# EAGLE design Movuino_v0.922 (EAGLE 6.6.0)
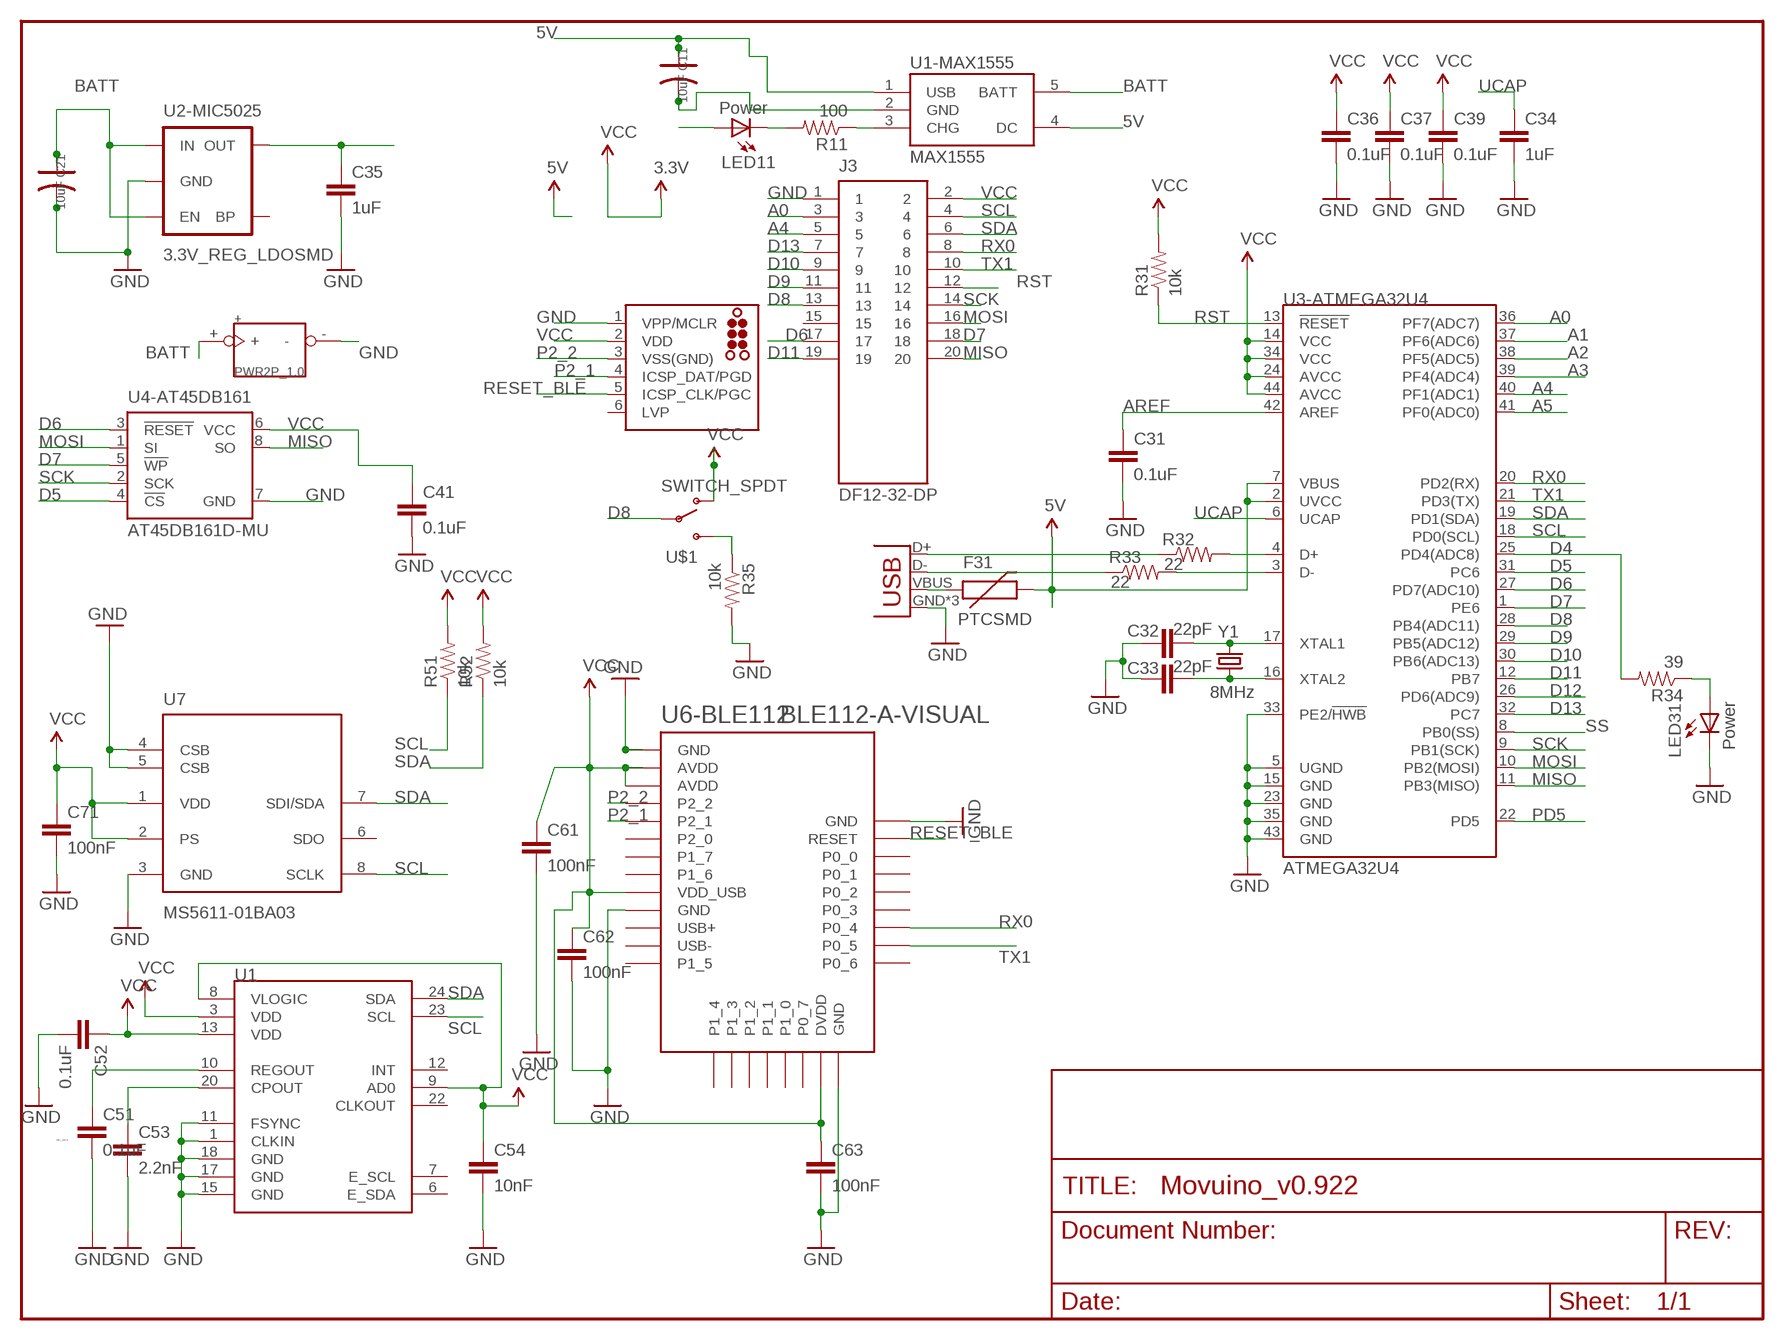
[diagram p0: schematic, sheet 1]

## Parts
+  PWR2P_1.0  [PWR2P_1.0]
C11  10uF  C-POLAR-A  [AVX-A]
C21  10uF  C-POLAR-A  [AVX-A]
C31  0.1uF  CAP0402-CAP  [0402-CAP]
C32  22pF  CAP0402-CAP  [0402-CAP]
C33  22pF  CAP0402-CAP  [0402-CAP]
C34  1uF  CAP0402-CAP  [0402-CAP]
C35  1uF  CAP0402-CAP  [0402-CAP]
C36  0.1uF  CAP0402-CAP  [0402-CAP]
C37  0.1uF  CAP0402-CAP  [0402-CAP]
C39  0.1uF  CAP0402-CAP  [0402-CAP]
C41  0.1uF  CAP0402-CAP  [0402-CAP]
C51  0.1uF  CAP0402-CAP  [0402-CAP]
C52  0.1uF  CAP0402-CAP  [0402-CAP]
C53  2.2nF  CAP0402-CAP  [0402-CAP]
C54  10nF  CAP0402-CAP  [0402-CAP]
C61  100nF  CAP0402-CAP  [0402-CAP]
C62  100nF  CAP0402-CAP  [0402-CAP]
C63  100nF  CAP0402-CAP  [0402-CAP]
C71  100nF  CAP0402-CAP  [0402-CAP]
F31  PTCSMD  [PTC-1206]
J1  TC2030-MCP-NL  [TC2030-MCP-NL]
J3  DF12-32-DP  AS-ITM-00015  [DF12-20-DP]
LED11  Power  LED0603  [LED-0603]
LED31  Power  LED0603  [LED-0603]
R11  100  RESISTOR0402-RES  [0402-RES]
R31  10k  RESISTOR0402-RES  [0402-RES]
R32  22  RESISTOR0402-RES  [0402-RES]
R33  22  RESISTOR0402-RES  [0402-RES]
R34  39  RESISTOR0402-RES  [0402-RES]
R35  10k  RESISTOR0402-RES  [0402-RES]
R51  10k  RESISTOR0402-RES  [0402-RES]
R52  10k  RESISTOR0402-RES  [0402-RES]
U1  MPU-9150QFN-24-NP  [QFN-24-NP]
U1-MAX1555  MAX1555  [SOT23-5]
U2-MIC5025  3.3V_REG_LDOSMD  V_REG_LDOSMD  [SOT23-5]
U3-ATMEGA32U4  ATMEGA32U4  ATMEGA32U4QFN2  [QFN-44-NOPAD]
U4-AT45DB161  AT45DB161D-MU  [VDFN-8]
U6-BLE112  BLE112-A-VISUAL  [BLE112-A]
U7  MS5611-01BA03  [SON125P300X500X100-8N]
U$1  SWITCH_SPDT  [KPS-1290]
X1  USB-MICROB  [USB-MICROB]
Y1  8MHz  CRYSTAL5X3  [CRYSTAL-SMD-5X3]

## Nets
5V: C11.+ F31.2 U1-MAX1555.1(USB) U1-MAX1555.4(DC) U3-ATMEGA32U4.2(UVCC) U3-ATMEGA32U4.7(VBUS)
A0: J3.3 U3-ATMEGA32U4.36(PF7(ADC7))
A1: U3-ATMEGA32U4.37(PF6(ADC6))
A2: U3-ATMEGA32U4.38(PF5(ADC5))
A3: U3-ATMEGA32U4.39(PF4(ADC4))
A4: J3.5 U3-ATMEGA32U4.40(PF1(ADC1))
A5: U3-ATMEGA32U4.41(PF0(ADC0))
AREF: C31.1 U3-ATMEGA32U4.42(AREF)
BATT: +.+ C21.+ LED11.A U1-MAX1555.5(BATT) U2-MIC5025.1(IN) U2-MIC5025.3(EN)
D4: R34.2 U3-ATMEGA32U4.25(PD4(ADC8))
D5: U3-ATMEGA32U4.31(PC6) U4-AT45DB161.4(!CS)
D6: J3.17 U3-ATMEGA32U4.27(PD7(ADC10)) U4-AT45DB161.3(!RESET)
D7: J3.18 U3-ATMEGA32U4.1(PE6) U4-AT45DB161.5(!WP)
D8: J3.13 U3-ATMEGA32U4.28(PB4(ADC11)) U$1.P
D9: J3.11 U3-ATMEGA32U4.29(PB5(ADC12))
D10: J3.9 U3-ATMEGA32U4.30(PB6(ADC13))
D11: J3.19 U3-ATMEGA32U4.12(PB7)
D12: U3-ATMEGA32U4.26(PD6(ADC9))
D13: J3.7 U3-ATMEGA32U4.32(PC7)
D+: R32.1 X1.D+
D-: R33.1 X1.D-
GND: +.- C11.- C21.- C31.2 C32.1 C33.1 C34.2 C35.2 C36.2 C37.2 C39.2 C41.2 C51.2 C52.2 C53.2 C54.2 C61.2 C62.2 C63.2 C71.2 J1.1(VPP/MCLR) J3.1 LED31.C R35.2 U1-MAX1555.2(GND) U1.1(CLKIN) U1.11(FSYNC) U1.15(GND) U1.17(GND) U1.18(GND) U2-MIC5025.2(GND) U3-ATMEGA32U4.5(UGND) U3-ATMEGA32U4.15(GND) U3-ATMEGA32U4.23(GND) U3-ATMEGA32U4.33(PE2/!HWB) U3-ATMEGA32U4.35(GND) U3-ATMEGA32U4.43(GND) U4-AT45DB161.7(GND) U6-BLE112.GND1(GND) U6-BLE112.GND2(GND) U6-BLE112.GND3(GND) U6-BLE112.GND4(GND) U7.3(GND) U7.4(CSB) U7.5(CSB) X1.GND X1.MT1(GND) X1.MT2(GND)
MISO: J3.20 U3-ATMEGA32U4.11(PB3(MISO)) U4-AT45DB161.8(SO)
MOSI: J3.16 U3-ATMEGA32U4.10(PB2(MOSI)) U4-AT45DB161.1(SI)
N$2: C32.2 U3-ATMEGA32U4.17(XTAL1) Y1.3
N$3: C33.2 U3-ATMEGA32U4.16(XTAL2) Y1.1
N$4: F31.1 X1.VBUS
N$6: R32.2 U3-ATMEGA32U4.4(D+)
N$7: R11.1 U1-MAX1555.3(CHG)
N$8: R33.2 U3-ATMEGA32U4.3(D-)
N$10: LED11.C R11.2
N$11: C51.1 U1.10(REGOUT)
N$19: C53.1 U1.20(CPOUT)
N$22: LED31.A R34.1
N$27: R35.1 U$1.S
P2_1: J1.4(ICSP_DAT/PGD) U6-BLE112.P2_1
P2_2: J1.3(VSS(GND)) U6-BLE112.P2_2
PD5: U3-ATMEGA32U4.22(PD5)
RESET_BLE: J1.5(ICSP_CLK/PGC) U6-BLE112.RESET
RST: J3.12 R31.1 U3-ATMEGA32U4.13(!RESET)
RX0: J3.8 U3-ATMEGA32U4.20(PD2(RX)) U6-BLE112.P0_4
SCK: J3.14 U3-ATMEGA32U4.9(PB1(SCK)) U4-AT45DB161.2(SCK)
SCL: J3.4 R51.1 U1.23(SCL) U3-ATMEGA32U4.18(PD0(SCL)) U7.8(SCLK)
SDA: J3.6 R52.1 U1.24(SDA) U3-ATMEGA32U4.19(PD1(SDA)) U7.7(SDI/SDA)
SS: U3-ATMEGA32U4.8(PB0(SS))
TX1: J3.10 U3-ATMEGA32U4.21(PD3(TX)) U6-BLE112.P0_5
UCAP: C34.1 U3-ATMEGA32U4.6(UCAP)
VCC: C35.1 C36.1 C37.1 C39.1 C41.1 C52.1 C54.1 C61.1 C62.1 C63.1 C71.1 J1.2(VDD) J3.2 R31.2 R51.2 R52.2 U1.3(VDD) U1.8(VLOGIC) U1.9(AD0) U1.13(VDD) U2-MIC5025.5(OUT) U3-ATMEGA32U4.14(VCC) U3-ATMEGA32U4.24(AVCC) U3-ATMEGA32U4.34(VCC) U3-ATMEGA32U4.44(AVCC) U4-AT45DB161.6(VCC) U6-BLE112.AVDD1(AVDD) U6-BLE112.AVDD2(AVDD) U6-BLE112.DVDD U6-BLE112.VDD_USB U7.1(VDD) U7.2(PS) U$1.O
Unconnected: J1.6(LVP) J3.15 U1.6(E_SDA) U1.7(E_SCL) U1.12(INT) U1.22(CLKOUT) U2-MIC5025.4(BP) U6-BLE112.P0_0 U6-BLE112.P0_1 U6-BLE112.P0_2 U6-BLE112.P0_3 U6-BLE112.P0_6 U6-BLE112.P0_7 U6-BLE112.P1_0 U6-BLE112.P1_1 U6-BLE112.P1_2 U6-BLE112.P1_3 U6-BLE112.P1_4 U6-BLE112.P1_5 U6-BLE112.P1_6 U6-BLE112.P1_7 U6-BLE112.P2_0 U6-BLE112.USB+ U6-BLE112.USB- U7.6(SDO)

## Notes on the sheet
- DC_V0.9

## Library data of the parts
+ = Seeeduino_Film_v0.9b:PWR2P
C11 C21 = OPL Eagle Library:C-POLAR*
C31-C37 C39 C41 C51-C54 C61-C63 C71 = SparkFun:CAP: Capacitor Standard 0603 ceramic capacitor, and 0.1" leaded capacitor.
F31 = SparkFun:PTC: Resettable Fuse PTC Resettable Fuse. Spark Fun Electronics SKU : COM-08357
J1 = tag-connect:TC2030: TAG-CONNECT ICSP Connector Manufacturer: Tag-Connect <http://www.tag-connect.com> Cable for easy In-Circuit Serial Programming. Designed for Microchip ICD2, suitable for many others. Two variants - one "with legs" (for hands-free fit on PCB) and another "without legs" for quick programming. PAD Description 1 MCLR/Vpp 2 Vdd 3 GND 4 PGD (ISPDAT) 5 PGC (ISPCLK) 6 nc (used for LVP) ©2009 ROFA.cz - modified and updated by Robert Darlington ‹rdarlington@gmail.com›
J3 = ASM2001-2:AS-ITM-00015: CONN HEADER 20POS 3MM SMD 0.5MM; PARTNO: AS-ITM-00015
LED11 LED31 = SparkFun:LED: LEDs Standard schematic elements and footprints for 5mm, 3mm, 1206, and 0603 sized LEDs. 5mm - Spark Fun Electronics SKU : COM-00529 (and others)
R11 R31-R35 R51 R52 = SparkFun:RESISTOR: Resistor Basic schematic elements and footprints for 0603, 1206, and PTH resistors.
U1 = SparkFun-Sensors:MPU-9150: 9DOF (3mag, 3accel, 3rotat). I2C interface.
U1-MAX1555 = LiPo-USB-Charger-v13:MAX1555: MAX1555 Lithium Charger IC SOT-23 Lithium Polymer charging IC. Schematic element and footprint proven. Spark Fun Electronics SKU : COM-00674
U2-MIC5025 = SparkFun:V_REG_LDO: Voltage Regulator LDO Standard 150mA LDO voltage regulator in SOT-23 layout. Micrel part MIC5205. BP (by-pass) pin is used to lower output noise with 470pF cap.
U3-ATMEGA32U4 = SparkFun:ATMEGA32U4
U4-AT45DB161 = myat45db161D-2:AT45DB161D: 16-megabit 2.5V or 2.7V DataFlash Source: http://www.atmel.com/dyn/resources/prod_documents/doc3500.pdf; MF: ATMEL; MPN: AT45DB161D-SU; OC_FARNELL: 1455040
U6-BLE112 = BLE-Shield-1_0_0-B:BLE112-A-VISUAL: Bluetooth Low Energy single-mode module - Bluetooth 4.0, chip antenna
U7 = Measurement-Specialties:MS5611-01BA03: Variometer Module, with stainless steel cap
U$1 = SparkFun-Electromechanical:SWITCH_SPDT: Side-actuated SPDT slide switch, as used on the Arduino Pro
X1 = SparkFun-Connectors:USB: USB Connectors USB-B-PTH is fully proven SKU : PRT-00139/CONN-08278 USB-miniB is fully proven SKU : PRT-00587 USB-A-PCB is untested. USB-A-H is throughly reviewed, but untested. Spark Fun Electronics SKU : PRT-00437 USB-B-SMT is throughly reviewed, but untested. Needs silkscreen touching up. USB-A-S has not been used/tested USB-MB-H has not been used/tested USB-MICROB has been used. CONN-09505; PROD_ID: CONN-09505
Y1 = SparkFun:CRYSTAL: Crystals Various standard crystals. Proven footprints. Spark Fun Electronics SKU : COM-00534

## Board
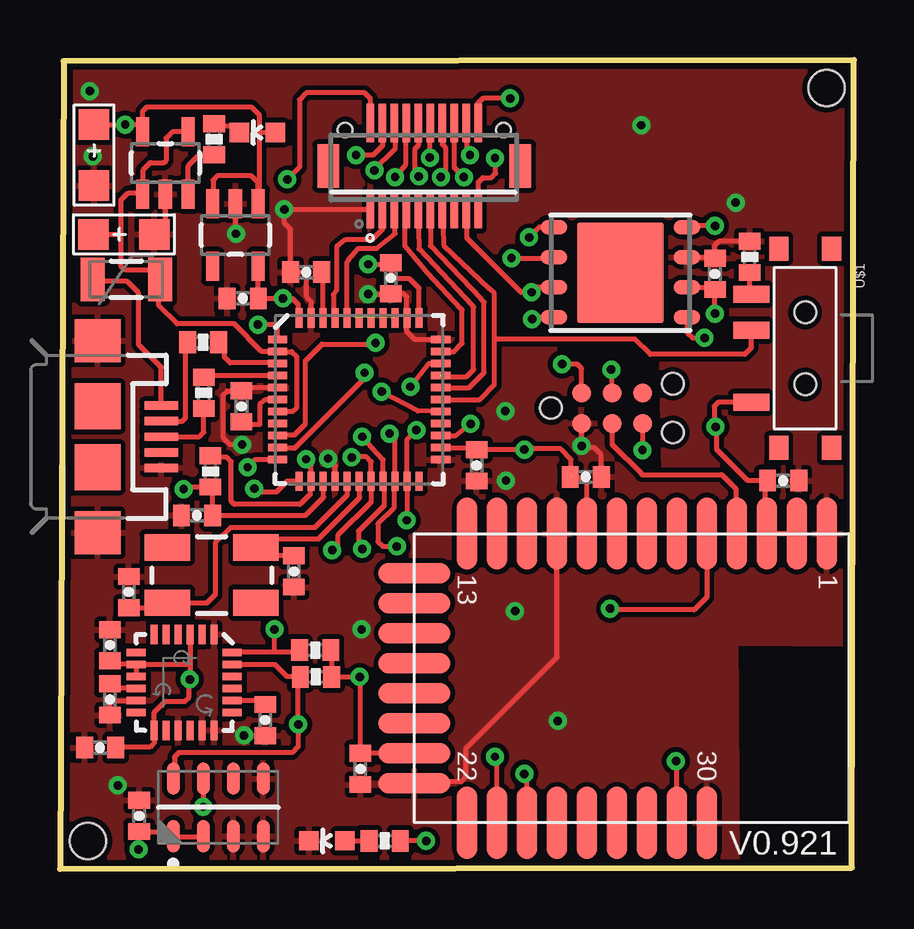
[diagram p1: board, top side]
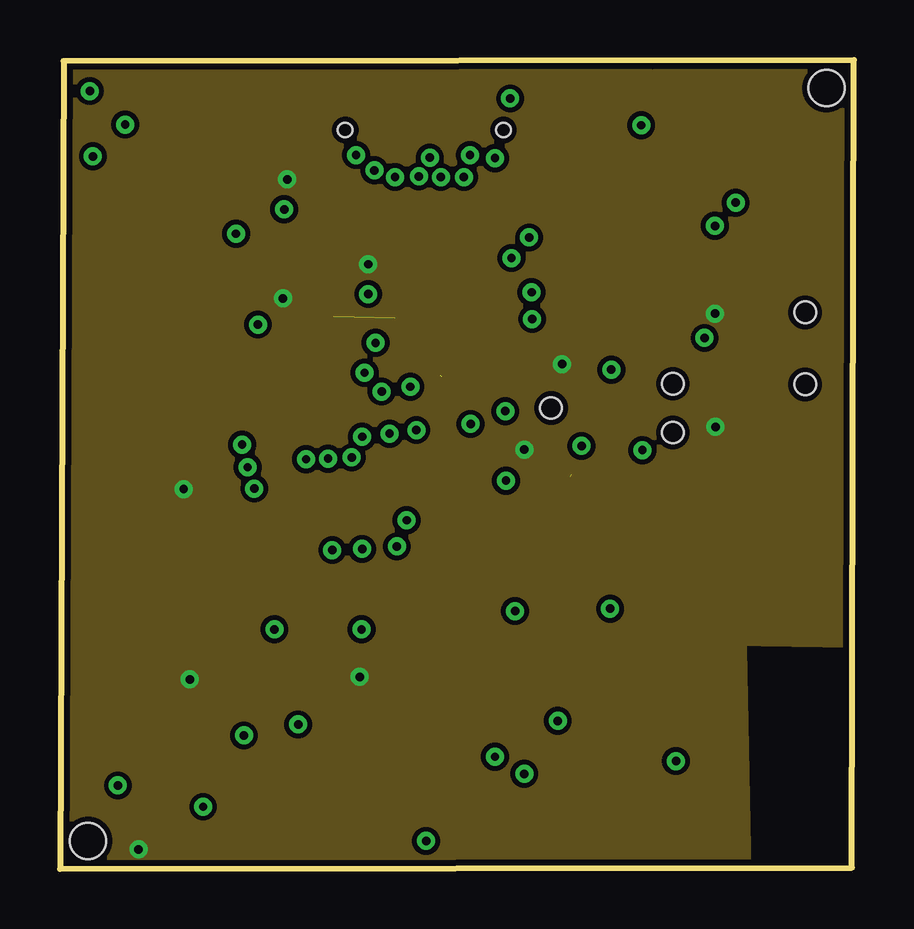
[diagram p2: board, inner layer VCC]
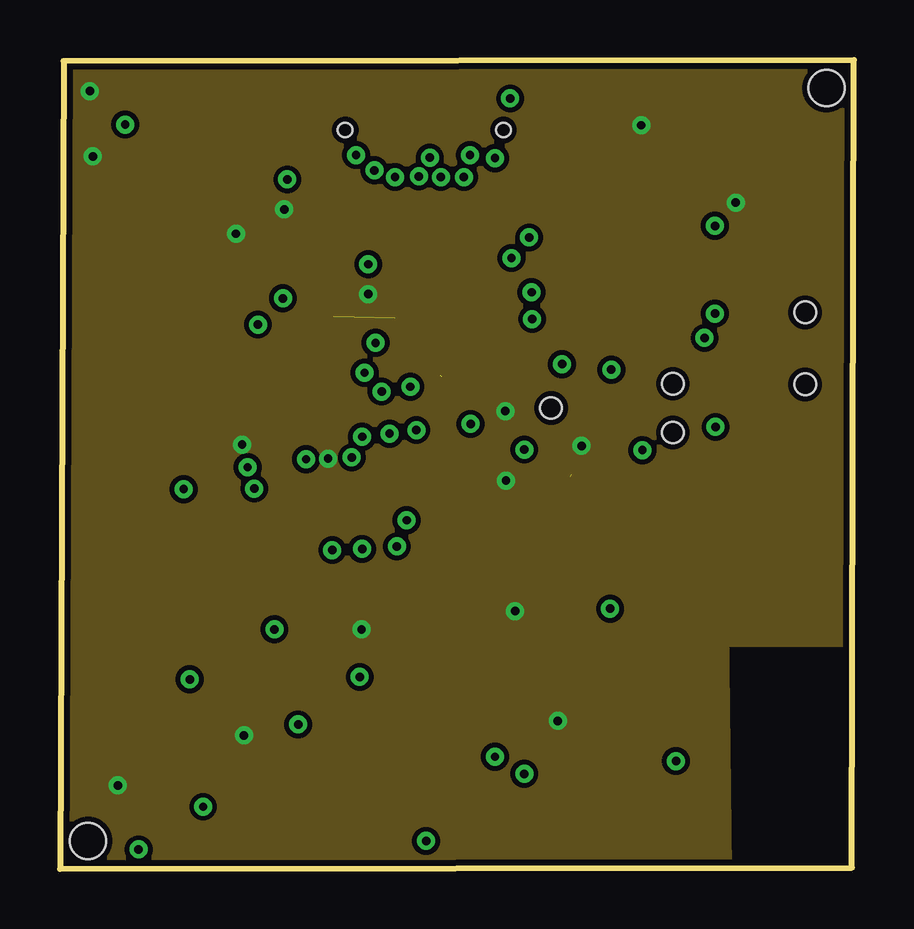
[diagram p3: board, inner layer GND]
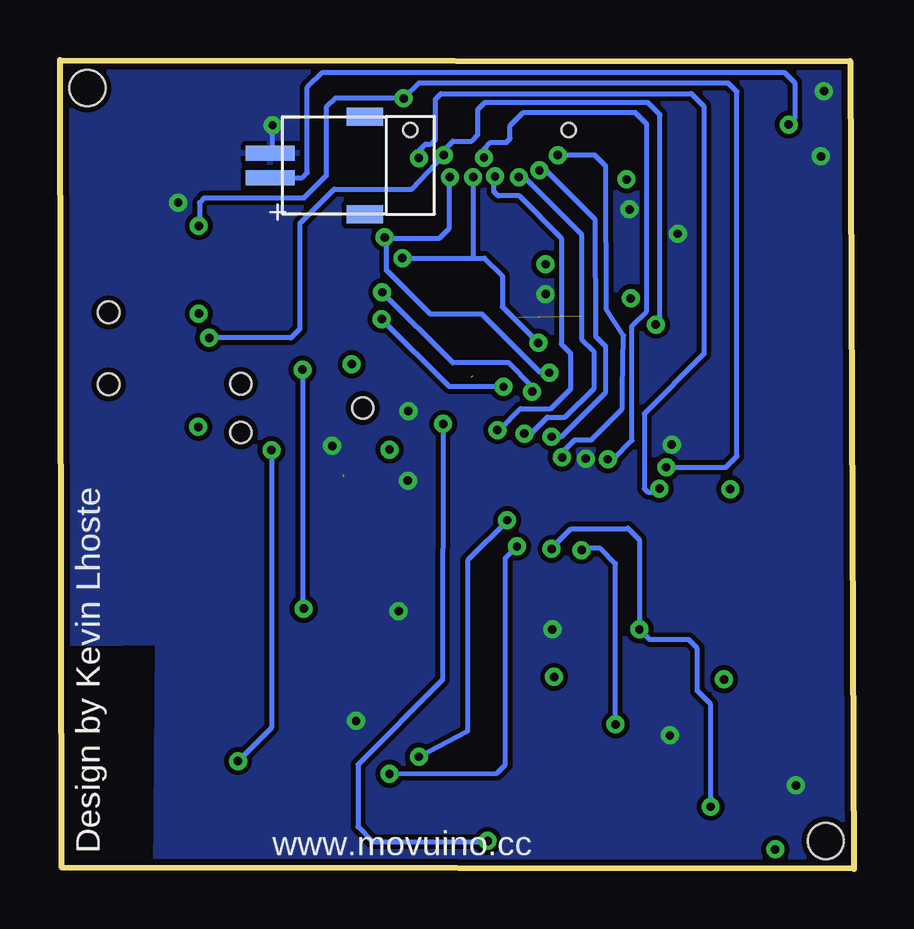
[diagram p4: board, bottom side, seen from below]

Size 33.1 x 33.71 mm. Coordinates in mm from the lower left corner, seen from the top.
Outline: 0,0 33.02,0.05 33.1,33.71 0.15,33.66 0,0
Copper layers (1+2*15+16): Top 0.018mm / dielectric 0.36mm / VCC 0.035mm / dielectric 0.71mm / GND 0.035mm / dielectric 0.2mm / Bottom 0.018mm
Design rules "eC_4Layer_PClass6_BaseCopperO18-I35_eCDefault *": minimum track width 0.15mm, minimum drill 0.35mm, track to track 0.15mm, track to pad 0.15mm, pad to pad 0.15mm, via to via 0.15mm, smd to smd 0mil, copper to edge 0.25mm, drill to drill 0.35mm, minimum pad ring 0.175mm, minimum via ring 0.125mm, stop-mask expansion 0mil, vias tented up to drill 0.45mm, thermal gap 0.2mm
Holes 1.5 mm at 31.95,32.54 1.17,1.17

### Footprints (pad centres in the part's own frame; a part is rotated, then mirrored left to right if it is on the bottom)
PWR2P_1.0 = smd 2.032 x 0.635: + 0.508,0.508; - 0.508,-0.508 | smd 1.524 x 0.762: P$3 -3.429,2.032; P$4 -3.429,-2.032
AVX-A = smd 1.27 x 1.27: + -1.27,0; - 1.27,0
0402-CAP = smd 0.7 x 0.9: 1 -0.65,0; 2 0.65,0
PTC-1206 = smd 1 x 1.8: 1 -1.4,0; 2 1.4,0
TC2030-MCP-NL = smd 0.787 x 0.787: 1 1.27,-0.635; 2 1.27,0.635; 3 2.54,-0.635; 4 2.54,0.635; 5 3.81,-0.635; 6 3.81,0.635 | hole 0.889: 0,0; 5.08,-1.016; 5.08,1.016
DF12-20-DP = smd 0.3 x 1.6: 1 -2.25,-1.8; 2 -2.25,1.8; 3 -1.75,-1.8; 4 -1.75,1.8; 5 -1.25,-1.8; 6 -1.25,1.8; 7 -0.75,-1.8; 8 -0.75,1.8; 9 -0.25,-1.8; 10 -0.25,1.8; 11 0.25,-1.8; 12 0.25,1.8; 13 0.75,-1.8; 14 0.75,1.8; 15 1.25,-1.8; 16 1.25,1.8; 17 1.75,-1.8; 18 1.75,1.8; 19 2.25,-1.8; 20 2.25,1.8 | smd 0.9 x 1.8: F1 -4,0; F2 4,0 | hole 0.6: -3.3,1.5; 3.3,1.5
LED-0603 = smd 0.8 x 0.8: A 0,-0.75; C 0,0.75
0402-RES = smd 0.7 x 0.9: 1 -0.65,0; 2 0.65,0
QFN-24-NP = smd 0.8 x 0.3: 1 -2,1.25; 2 -2,0.75; 3 -2,0.25; 4 -2,-0.25; 5 -2,-0.75; 6 -2,-1.25; 13 2,-1.25; 14 2,-0.75; 15 2,-0.25; 16 2,0.25; 17 2,0.75; 18 2,1.25 | smd 0.3 x 0.8: 7 -1.25,-2; 8 -0.75,-2; 9 -0.25,-2; 10 0.25,-2; 11 0.75,-2; 12 1.25,-2; 19 1.25,2; 20 0.75,2; 21 0.25,2; 22 -0.25,2; 23 -0.75,2; 24 -1.25,2
SOT23-5 = smd 0.55 x 1.2: 1 -0.95,-1.3; 2 0,-1.3; 3 0.95,-1.3; 4 0.95,1.3; 5 -0.95,1.3
QFN-44-NOPAD = smd 0.8 x 0.3: 1 -3.4,2.5; 2 -3.4,2; 3 -3.4,1.5; 4 -3.4,1; 5 -3.4,0.5; 6 -3.4,0; 7 -3.4,-0.5; 8 -3.4,-1; 9 -3.4,-1.5; 10 -3.4,-2; 11 -3.4,-2.5; 23 3.4,-2.5; 24 3.4,-2; 25 3.4,-1.5; 26 3.4,-1; 27 3.4,-0.5; 28 3.4,0; 29 3.4,0.5; 30 3.4,1; 31 3.4,1.5; 32 3.4,2; 33 3.4,2.5 | smd 0.3 x 0.8: 12 -2.5,-3.4; 13 -2,-3.4; 14 -1.5,-3.4; 15 -1,-3.4; 16 -0.5,-3.4; 17 0,-3.4; 18 0.5,-3.4; 19 1,-3.4; 20 1.5,-3.4; 21 2,-3.4; 22 2.5,-3.4; 34 2.5,3.4; 35 2,3.4; 36 1.5,3.4; 37 1,3.4; 38 0.5,3.4; 39 0,3.4; 40 -0.5,3.4; 41 -1,3.4; 42 -1.5,3.4; 43 -2,3.4; 44 -2.5,3.4
VDFN-8 = smd 1.1 x 0.6: 1 -2.775,1.9; 2 -2.775,0.65; 3 -2.775,-0.6; 4 -2.775,-1.85; 5 2.775,-1.85; 6 2.775,-0.6; 7 2.775,0.65; 8 2.775,1.9 | smd 3.6 x 4.2: 9 0,0
BLE112-A = smd 3 x 0.85: AVDD1 -6.05,6.9; AVDD2 -6.05,5.65; GND1 -6.05,8.15; GND2 -6.05,-3.1; GND4 6,3.15; P0_0 6,0.65; P0_1 6,-0.6; P0_2 6,-1.85; P0_3 6,-3.1; P0_4 6,-4.35; P0_5 6,-5.6; P0_6 6,-6.85; P1_5 -6.05,-6.85; P1_6 -6.05,-0.6; P1_7 -6.05,0.65; P2_0 -6.05,1.9; P2_1 -6.05,3.15; P2_2 -6.05,4.4; RESET 6,1.9; USB+ -6.05,-4.35; USB- -6.05,-5.6; VDD_USB -6.05,-1.85 | smd 0.85 x 3: DVDD 3.1,-9.05; GND3 4.35,-9.05; P0_7 1.85,-9.05; P1_0 0.6,-9.05; P1_1 -0.65,-9.05; P1_2 -1.9,-9.05; P1_3 -3.15,-9.05; P1_4 -4.4,-9.05
SON125P300X500X100-8N = smd 1.35 x 0.55: 1 -1.2,1.875; 2 -1.2,0.625; 3 -1.2,-0.625; 4 -1.2,-1.875; 5 1.2,-1.875; 6 1.2,-0.625; 7 1.2,0.625; 8 1.2,1.875
KPS-1290 = smd 0.7 x 1.5: O -2.25,2.25; P 0.75,2.25; S 2.25,2.25 | smd 1 x 0.8: P$1 -4.15,1.1; P$2 -4.15,-1.1; P$3 4.15,-1.1; P$4 4.15,1.1 | hole 0.9: -1.5,0; 1.5,0
USB-MICROB = smd 0.35 x 1.4: D+ 0,2.65; D- -0.65,2.65; GND 1.3,2.65; ID 0.65,2.65; VBUS -1.3,2.65 | smd 1.8 x 1.9: MT1 -4,0; MT2 4,0 | smd 1.9 x 1.9: P$1 -1.27,0; P$2 1.27,0
CRYSTAL-SMD-5X3 = smd 1.9 x 1.1: 1 -1.85,-1.15; 2 1.85,-1.15; 3 1.85,1.15; 4 -1.85,1.15

### Placement (x,y rotation side)
+  23.83,29.31 180 bottom
C11  2.67,26.44 0 top
C21  1.42,29.74 270 top
C31  10.26,24.87 180 top
C32  9.75,12.4 90 top
C33  2.87,11.53 270 top
C34  7.57,19.28 90 top
C35  7.62,23.77 180 top
C36  13.79,24.61 270 top
C37  17.37,16.81 270 top
C39  5.71,14.73 180 top
C41  27.3,24.79 90 top
C51  2.08,7.06 270 top
C52  1.68,5.05 180 top
C53  8.56,6.2 270 top
C54  2.08,9.32 90 top
C61  30.15,16.18 0 top
C62  21.92,16.33 0 top
C63  12.52,4.17 270 top
C71  3.3,2.21 90 top
F31  2.77,24.56 0 top
J1  20.47,19.2 0 top
J3  15.19,29.29 0 top
LED11  8.23,30.68 90 top
LED31  11.13,1.17 90 top
R11  6.43,30.4 90 top
R31  6.27,16.56 270 top
R32  5.99,19.84 90 top
R33  5.97,21.95 0 top
R34  13.54,1.17 0 top
R35  28.75,25.5 90 top
R51  10.67,8 0 top
R52  10.64,9.12 0 top
U1  5.18,7.77 270 top
U1-MAX1555  4.39,29.41 0 top
U2-MIC5025  7.32,26.42 180 top
U3-ATMEGA32U4  12.47,19.56 0 top
U4-AT45DB161  23.37,24.84 0 top
U6-BLE112  23.83,7.92 270 top
U7  6.6,2.57 90 top
U$1  31.06,21.69 90 top
X1  1.57,18.01 270 top
Y1  6.32,12.24 0 top

### Tracks (layer width: path | path; a pad name or v marks a point on that pad's centre or on a via)
5V
  Top 0.203: U1-MAX1555.1 3.45,28.12 3.45,29.11 3.79,29.44 3.81,29.41 4.32,29.41 4.42,29.52 4.42,30.45 4.68,30.71 U1-MAX1555.4 | U1-MAX1555.1 | U1-MAX1555.1 3.39,28.17 2.84,28.17 2.54,27.86 2.54,26.44 | U3-ATMEGA32U4.7 9.08,19.05 9.7,19.05 9.86,19.2 9.86,21.36 9.66,21.56 U3-ATMEGA32U4.2 8.41,21.56 7.26,22.71 4.88,22.71 4.12,23.47 4.12,24.51 F31.2 3.76,24.97 2.69,24.97 2.54,25.12 2.54,26.44 | C11.+ 2.54,26.44
A0  (1 unrouted)
  Top 0.203: J3.3 13.44,26.65 13.01,26.21 11.89,26.21 11.53,25.93 11.53,24.13 11.41,23.93 11.41,23.03
A4
  Top 0.203: J3.5 13.97,27.46 13.97,26.47 13.21,25.86 12.45,25.86 12.04,25.37 11.97,25.31 U3-ATMEGA32U4.40
AREF
  Top 0.203: U3-ATMEGA32U4.42 10.97,24.83 C31.1
BATT  (via drill 0.35 pad 0.75)
  Top 0.203: U2-MIC5025.3 6.38,28.7 6.55,28.88 7.98,28.88 8.27,28.59 U2-MIC5025.1 8.31,27.76 8.31,30.66 | 3.44,31.01 3.44,31.56 3.63,31.75 7.98,31.75 8.31,31.42 8.31,30.66 | LED11.A 8.33,30.68 8.31,30.66 | C21.+ v2.72,31.01 3.44,31.01 | U1-MAX1555.5 3.44,31.01
  Bottom 0.203: +.+ 22.99,28.8 22.78,29.01 22.78,32.56 22.17,33.17 2.87,33.17 2.46,32.77 2.46,31.27 v2.72,31.01
D4  (via drill 0.35 pad 0.75)
  Top 0.203: U3-ATMEGA32U4.25 16.48,18.06 v17.12,18.54 | v15.27,1.17 R34.2
  Bottom 0.203: v17.12,18.54 17.14,8.15 17.14,7.87 20.68,4.34 20.68,1.75 20.07,1.14 15.29,1.14 v15.27,1.17
D5  (via drill 0.35 pad 0.75)
  Top 0.203: U3-ATMEGA32U4.31 15.37,21.06 v14.61,20.09 | 19.71,22.89 v19.68,22.91 19.77,22.99 U4-AT45DB161.4
  Bottom 0.203: v14.61,20.09 16.87,20.09 v19.68,22.91
D6  (via drill 0.35 pad 0.75)
  Top 0.203: U3-ATMEGA32U4.27 14.92,19.08 v13.41,19.89 | J3.17 16.97,27.46 16.97,26.29 19.23,24.03 v19.66,24.03 19.87,24.24 U4-AT45DB161.3
  Bottom 0.203: v13.41,19.89 13.41,20.12 14.38,21.08 16.71,21.08 v19.66,24.03
D7  (via drill 0.35 pad 0.75)
  Top 0.203: J3.18 16.94,29.9 v17.09,29.74 | U3-ATMEGA32U4.1 9.07,22.55 8.94,22.68 v8.26,22.68 | v26.87,22.12 26.36,22.12 26.16,22.33 26.16,22.97 U4-AT45DB161.5
  Bottom 0.203: v17.09,29.74 18.41,28.32 21.67,28.32 23.09,26.9 23.09,22.5 23.47,22.12 v26.87,22.12 | v17.09,29.74 17.09,29.77 | v17.09,29.74 17.09,29.95 16.71,30.33 15.93,30.33 15.67,30.58 15.67,31.65 15.39,31.93 8.59,31.93 8.08,31.42 8.08,22.86 v8.26,22.68
D8
  Top 0.203: J3.13 15.99,26 17.91,24.18 18.11,23.98 18.11,22.02 | U3-ATMEGA32U4.28 17.5,19.56 18.11,20.17 18.11,22.02 | 28.89,22.21 U$1.P 28.83,22.43 28.83,21.72 28.55,21.44 24.61,21.44 23.98,22.07 18.16,22.07 18.11,22.02
D9
  Top 0.203: J3.11 15.44,25.96 17.55,23.75 17.68,23.62 17.68,20.68 17.06,20.06 U3-ATMEGA32U4.29
D10  (1 unrouted)
  Top 0.203: J3.9 14.94,27.44 14.96,25.83 17.2,23.47 17.25,23.42 17.25,20.8 16.94,20.5 15.93,20.5
D11  (via drill 0.35 pad 0.75)
  Top 0.203: U3-ATMEGA32U4.12 9.48,16.16 9.02,15.7 8.26,15.7 v8.1,15.85 | J3.19 17.44,28.62 17.63,28.8 17.98,28.8 18.16,28.98 18.16,29.59 v18.14,29.62
  Bottom 0.203: v18.14,29.62 18.14,29.92 17.86,30.2 17.63,30.2 17.45,30.38 17.45,32.08 17.22,32.31 6.78,32.31 6.25,31.78 6.25,21.46 8.74,18.97 8.74,15.85 8.59,15.7 8.26,15.7 v8.1,15.85
D13
  Top 0.203: J3.7 14.4,27.45 14.38,25.96 15.32,24.84 16.71,23.34 16.76,23.29 16.76,21.9 16.43,21.56 U3-ATMEGA32U4.32
D+
  Top 0.203: X1.D+ 5.82,18.01 5.99,18.19 R32.1
D-
  Top 0.203: 5.23,21.66 R33.1 5.23,21.86 5.23,18.8 5.09,18.66 X1.D-
GND  (via drill 0.35 pad 0.75)
  Top 0.203: U3-ATMEGA32U4.5 7.77,20.06 C34.2 7.55,19.91 6.96,19.91 6.81,19.76 6.81,17.98 | 11.48,16.16 U3-ATMEGA32U4.15 11.47,16.8 v11.18,17.09 | 26.41,25.39 U4-AT45DB161.7 27.25,25.49 C41.2 | U3-ATMEGA32U4.33 14.8,22.06 14.45,22.4 14.45,22.94 | 14.45,22.94 U3-ATMEGA32U4.35 | U3-ATMEGA32U4.43 10.46,23.65 10.29,23.83 10.29,24.77 10.19,24.87 C31.2 9.61,26.66 9.35,26.92 v9.35,27.48 J3.1 | 14.45,22.94 14.45,23.85 14.33,23.98 13.81,23.98 C36.2 13.78,23.95 v12.85,23.95 | 27.33,25.34 C41.2 | J1.1 v21.74,17.63 21.82,17.55 22.28,17.55 22.57,17.26 C62.2 | 28.64,26.04 R35.2 27.47,26.15 27.28,25.96 27.28,25.47 C41.2 | 27.28,25.19 C41.2 | v7.59,17.68 7.09,17.68 6.83,17.93 | 4.42,28.09 U1-MAX1555.2 4.39,26.9 C11.- | v7.34,26.47 7.31,26.47 U2-MIC5025.2 | C51.2 2.08,6.86 2.24,7.01 U1.11 | U6-BLE112.GND3 14.86,3.63 16.71,3.63 16.92,3.84 16.92,5 20.72,8.81 U6-BLE112.GND2
  Bottom 0.203: +.- 24.23,29.82 v24.23,30.99
  other vias: 7.67,5.56 18.57,19.08 20.75,6.17 12.57,9.98 18.97,10.74 1.24,32.41 18.59,16.18 28.17,27.76 1.37,29.69 2.41,3.48
  pour GND (isolate 0.203): 27.48,33.68 0.15,33.71 -0.03,0.05 27.91,-0.05
  pour Top (isolate 0.203): 28.04,33.58 0.15,33.68 -0.03,0.05 28.24,-0.1
  pour Top (isolate 0.203): 33.3,33.66 24.82,33.71 25.35,9.45 33.1,9.37
  pour Top (isolate 0.203): 33.45,33.68 24.82,33.68 25.32,9.45 33.07,9.45
  pour Bottom (isolate 0.203): 33.2,33.66 24.82,33.71 25.83,9.42 33.05,9.42
  pour Bottom (isolate 0.203): 33.3,33.68 24.82,33.71 25.32,9.45 33.07,9.37
  pour GND (isolate 0.203): 33.17,33.55 24.82,33.71 25.35,9.45 33.02,9.45
  pour GND (isolate 0.203): 33.25,33.63 24.82,33.71 25.88,9.37 33.07,9.37
  pour Bottom (isolate 0.203): 28.8,33.5 0.23,33.66 -0.05,0 29.08,-0.18
MISO  (via drill 0.35 pad 0.75)
  Top 0.203: 17.45,31.08 J3.20 17.4,31.13 17.4,31.88 17.63,32.11 v18.77,32.11 | U3-ATMEGA32U4.11 8.14,17.06 v7.82,16.74 | v27.3,26.8 26.2,26.8 U4-AT45DB161.8
  Bottom 0.203: v7.82,16.74 5.33,16.74 4.88,17.2 4.88,32.39 5.23,32.74 18.14,32.74 v18.77,32.11 18.8,32.13 21.61,32.13 22,31.75 22,28.88 22.91,27.97 27.08,27.97 27.28,27.76 27.28,26.82 v27.3,26.8
MOSI  (via drill 0.35 pad 0.75)
  Top 0.203: J3.16 16.43,29.24 v16.84,28.83 16.59,29.03 | v12.7,20.68 12.7,20.45 9.78,17.53 9.1,17.53 U3-ATMEGA32U4.10 | 19.58,26.34 v19.56,26.31 19.98,26.74 U4-AT45DB161.1
  Bottom 0.203: v12.7,20.68 13.06,20.68 15.49,23.11 17.65,23.11 19.48,24.94 19.48,26.24 v19.56,26.31 19.53,26.29 17.27,26.29 16.87,26.7 16.87,28.8 v16.84,28.83
N$2
  Top 0.203: U3-ATMEGA32U4.17 12.5,16.13 12.5,15.47 10.77,13.74 8.52,13.74 Y1.3 8.31,13.07 9.8,13.07 C32.2
N$3
  Top 0.203: U3-ATMEGA32U4.16 11.97,15.58 10.62,14.22 7.11,14.22 6.48,13.59 6.48,11.43 6.12,11.07 4.49,11.07 Y1.1 | 4.85,11.07 Y1.1 | C33.2 3.87,10.88 3.96,10.97 4.35,10.97 Y1.1
N$4
  Top 0.203: F31.1 1.45,24.49 2.79,24.49 3.28,24 3.28,21.84 4.22,20.9 X1.VBUS
N$6
  Top 0.203: U3-ATMEGA32U4.4 6.37,20.56 R32.2
N$7
  Top 0.203: U1-MAX1555.3 5.34,29.3 5.77,29.72 6.39,29.72 R11.1
N$8
  Top 0.203: U3-ATMEGA32U4.3 9.05,21.08 7.09,21.08 6.86,21.31 6.86,21.91 R33.2
N$10
  Top 0.203: LED11.C 7.62,30.95 6.53,30.95 R11.2
N$11
  Top 0.203: U1.10 2.08,7.52 C51.1
N$19
  Top 0.203: U1.20 8.38,7.02 C53.1
N$22
  Top 0.203: LED31.A R34.1
N$27
  Top 0.203: 28.76,24.89 R35.1 28.75,23.94 U$1.S
P2_1  (via drill 0.35 pad 0.75)
  Top 0.203: J1.4 23.01,20.78 v22.99,20.8 | U6-BLE112.P2_1 26.97,11.33 26.44,10.8 22.99,10.8 v22.94,10.85
  Bottom 0.203: v22.99,20.8 22.99,10.9 v22.94,10.85
P2_2
  Top 0.203: J1.3 23.01,17.7 24.26,16.46 24.26,16.43 27.58,16.43 28.17,15.85 28.17,14.01 U6-BLE112.P2_2
RESET_BLE  (via drill 0.35 pad 0.75)
  Top 0.203: J1.5 v24.28,17.45 | U6-BLE112.RESET 25.72,4.45 v25.68,4.5
  Bottom 0.203: v24.28,17.45 24.28,5.89 v25.68,4.5
RST  (via drill 0.35 pad 0.75)
  Top 0.203: R31.1 6.34,17.15 6.96,17.15 7.14,16.97 7.14,15.32 7.26,15.19 10.01,15.19 10.43,15.61 10.43,16.12 U3-ATMEGA32U4.13 10.47,16.86 v10.26,17.07 | v15.42,29.64 J3.12
  Bottom 0.203: v15.42,29.64 15.42,30 15.14,30.28 14.48,30.28 14.33,30.43 14.33,30.96 13.77,31.52 9.12,31.52 8.64,31.04 8.64,23.24 9.25,22.63 9.25,17.86 10.03,17.07 v10.26,17.07
RX0  (via drill 0.35 pad 0.75)
  Top 0.203: J3.8 14.4,31.05 14.4,29.34 v13.97,28.83 | v13.74,18.14 13.97,17.91 U3-ATMEGA32U4.20 13.92,16.11 13.92,15.04 13.26,14.38 13.26,13.64 13.46,13.44 v14.05,13.44 | U6-BLE112.P0_4 19.47,3.84 v19.36,3.96
  Bottom 0.203: v19.36,3.96 14.88,3.99 14.53,4.34 14.53,12.95 v14.05,13.44 | v13.74,18.14 13.46,18.14 12.78,18.82 12.04,18.82 10.85,20.02 10.85,21.56 11.35,22.07 11.35,26.44 13.74,28.83 v13.97,28.83
SCK  (via drill 0.35 pad 0.75)
  Top 0.203: U3-ATMEGA32U4.9 9.1,18.09 9.78,18.09 10.24,18.54 10.24,21.18 10.92,21.87 13.11,21.87 v13.16,21.92 | J3.14 15.94,30.19 16.08,30.05 16.08,29.03 v15.88,28.83 | v18.82,25.45 20.55,25.45 U4-AT45DB161.2
  Bottom 0.203: v18.82,25.45 15.93,25.45 | 15.93,25.45 15.39,25.45 14.66,24.71 14.66,23.42 v13.16,21.92 | v15.88,28.83 15.88,25.5 15.93,25.45
SCL  (via drill 0.35 pad 0.75)
  Top 0.203: J3.4 13.44,30.13 13.06,29.74 v12.34,29.74 | v11.35,13.28 11.58,13.51 11.58,13.89 12.97,15.28 U3-ATMEGA32U4.18 12.97,16.98 12.78,17.17 12.19,17.17 v12.17,17.15 | 9.83,7.87 R51.1 | U1.23 8.95,8.52 9.45,8.03 9.97,8.03 R51.1 | U7.8 4.77,3.81 4.77,4.67 4.95,4.85 9.68,4.85 9.93,5.11 v9.93,6.02 9.93,7.99 R51.1
  Bottom 0.203: 12.19,29.72 v12.34,29.74 10.79,29.74 10.34,29.29 10.34,28.93 10.31,23.29 9.6,22.23 9.65,19.96 9.65,19.18 10.95,17.88 11.63,17.88 12.17,17.35 v12.17,17.15 | v9.93,6.02 9.93,12.73 10.57,13.36 11.28,13.36 v11.35,13.28
SDA  (via drill 0.35 pad 0.74, 0.35 pad 0.75)
  Top 0.203: J3.6 13.97,31.06 13.97,30 13.06,29.08 13.08,29.08 v13.11,29.11 | v12.6,13.34 12.45,13.49 12.45,14.07 13.51,15.14 13.51,16.12 U3-ATMEGA32U4.19 13.47,17.06 v12.6,18.01 | 7.4,9.04 U1.24 7.2,9.04 | U7.7 5.98,2.55 v5.97,2.59 | R52.1 9.91,9.04 7.2,9.04 | 7.2,9.04 8.92,9.04 8.94,9.07 v8.94,9.98
  Bottom 0.203: v12.6,13.34 12.6,13.36 11.79,14.17 9.45,14.17 9.42,14.2 8.94,13.72 v8.94,9.98 8.51,9.55 6.88,9.55 6.53,9.2 6.53,7.42 5.97,6.86 v5.97,2.59 | v13.11,29.11 12.83,29.11 10.79,27.08 10.77,22.2 10.34,21.77 10.34,19.86 12.19,18.01 v12.6,18.01
TX1  (via drill 0.35 pad 0.75)
  Top 0.203: v14.45,14.53 14.47,14.6 U3-ATMEGA32U4.21 14.47,17.9 v14.86,18.29 | J3.10 14.94,30.15 14.78,30 14.78,29.03 v14.96,28.85 | U6-BLE112.P0_5 18.22,4.58 v18.14,4.67
  Bottom 0.203: v14.45,14.53 14.43,14.53 16.1,12.85 16.1,5.74 v18.14,4.67 | v14.86,18.29 14.78,18.29 13.89,19.18 12.62,19.18 11.81,19.99 11.81,21.49 12.19,21.87 12.19,26.29 13.95,28.04 14.83,28.04 15.01,28.22 15.01,28.8 v14.96,28.85 15.01,28.83
UCAP
  Top 0.203: C34.1 7.9,18.75 | 7.54,18.68 C34.1 | U3-ATMEGA32U4.6 8.56,19.56 8.33,19.36 8.33,18.52 7.66,18.52 C34.1
VCC  (via drill 0.35 pad 0.75)  (1 unrouted)
  Top 0.203: U6-BLE112.AVDD1 U6-BLE112.AVDD2 29.41,15.23 29.41,16.09 C61.1 | U2-MIC5025.5 C35.1 v9.3,23.77 9.68,23.77 9.93,23.52 9.93,23 U3-ATMEGA32U4.44 | U3-ATMEGA32U4.14 11,16.13 11,15.49 10.24,14.73 C39.1 6.37,15.82 R31.2 | 6.31,15.88 R31.2 | 13.02,4.83 C63.1 | 29.36,15.88 29.59,16.18 29.59,16.14 C61.1 | 14.96,4.85 13.46,4.85 U6-BLE112.DVDD 13.09,4.83 C63.1 | R31.2 5.24,15.91 v5.16,15.82 | U3-ATMEGA32U4.24 17.28,17.56 C37.1 17.38,17.48 v19.36,17.48 19.38,17.5 20.88,17.5 21.31,17.07 21.31,16.43 21.44,16.31 21.84,16.31 21.95,16.21 21.95,14 U6-BLE112.VDD_USB | 21.69,19.84 J1.2 21.74,20.85 21.56,21.03 v20.93,21.03 | U3-ATMEGA32U4.34 14.97,24.2 14.58,24.59 13.87,24.59 13.82,24.64 13.82,25.24 C36.1 13.73,25.2 v12.85,25.2 | v27.3,23.14 C41.1 27.2,24.24 U4-AT45DB161.6 | U$1.O 27.44,19.44 27.28,19.28 27.28,18.47 v27.33,18.42 | J3.2 12.94,32.1 12.7,32.33 10.26,32.33 9.98,32.06 9.98,29.24 v9.47,28.73 | 27.36,18.39 v27.33,18.42 | 2.06,8.47 C54.1 2.08,8.52 U1.8 | U1.3 5.43,8.56 | 5.43,8.56 5.43,7.92 v5.41,7.9 | U1.8 U1.9 | 5.25,7.74 v5.41,7.9 | U1.13 3.93,5.56 | R52.2 11.32,9.09 R51.2 v12.5,8 12.52,7.98 C63.1 | U1.13 3.93,6.52 4.39,6.99 5.21,6.99 5.38,7.16 5.38,7.87 v5.41,7.9 | U1.8 5.39,8.52 5.43,8.56 | U1.13 3.93,5.25 3.76,5.08 2.35,5.08 C52.1 | U7.2 5.98,1.33 4.73,1.33 U7.1 4.73,1.56 C71.1 3.28,1.56 v3.28,0.81 | C61.1 28.68,16.18 27.38,17.48 27.38,18.36 v27.33,18.42
  Top 0.218: 28.93,19.33 U$1.O
  pour VCC (isolate 0.203): 28.04,33.15 28.7,-0.18 0,0.08 0.15,33.68
  pour VCC (isolate 0.203): 33.07,33.68 24.82,33.68 25.37,9.47 33.1,9.35

### Text on the board
tNames: V0.921
bNames: Design by Kevin Lhoste | www.movuino.cc
tValues: Jordan McConnell